# Altium schematic sheet 02.SchDoc
size 297 x 209 mm
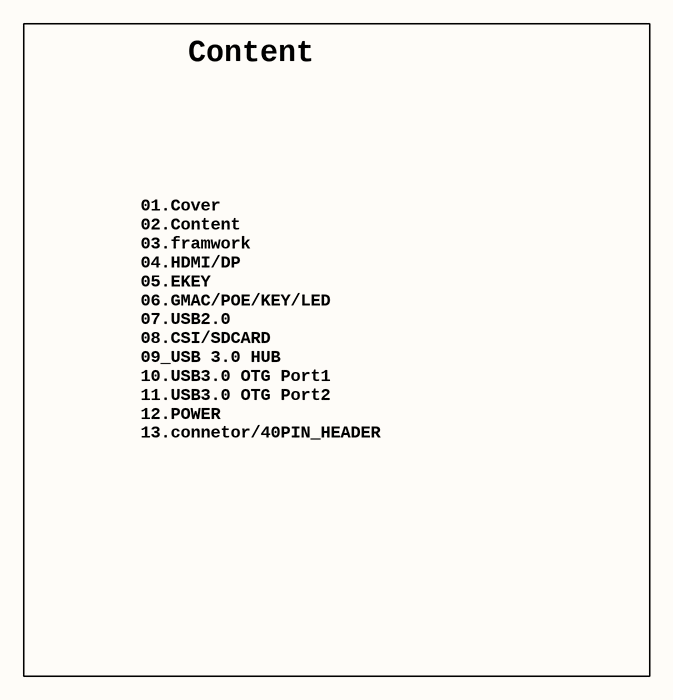
[diagram p0: 02.SchDoc]

## Notes on the sheet
- Content
- 01.Cover
  02.Content
  03.framwork
  04.HDMI/DP
  05.EKEY
  06.GMAC/POE/KEY/LED
  07.USB2.0
  08.CSI/SDCARD
  09_USB 3.0 HUB
  10.USB3.0 OTG Port1
  11.USB3.0 OTG Port2
  12.POWER
  13.connetor/40PIN_HEADER